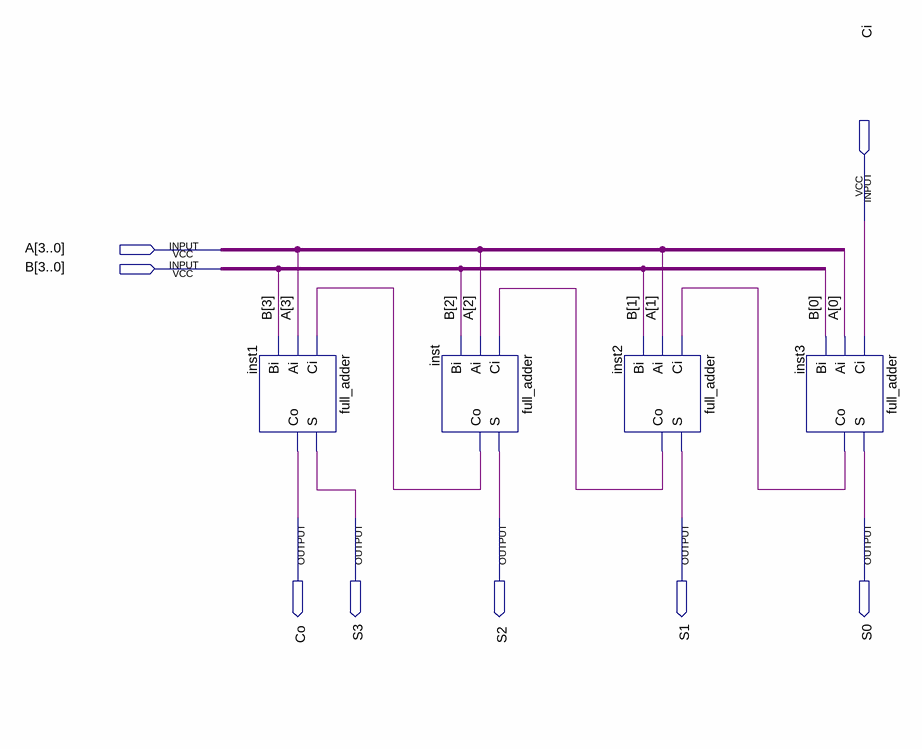
[diagram p0: schematic sheet]
// Quartus schematic ripple_adder.bdf as structural Verilog: 4 symbols, 8 pins
module ripple_adder (
  input  Ci,
  input  [3:0] A,
  input  [3:0] B,
  output Co,
  output S3,
  output S2,
  output S1,
  output S0
);

  wire inst2_co, inst3_co, inst_co;

  full_adder inst1 (.Ci(inst_co), .Ai(A[3]), .Bi(B[3]), .S(S3), .Co(Co));
  full_adder inst (.Ci(inst2_co), .Ai(A[2]), .Bi(B[2]), .S(S2), .Co(inst_co));
  full_adder inst2 (.Ci(inst3_co), .Ai(A[1]), .Bi(B[1]), .S(S1), .Co(inst2_co));
  full_adder inst3 (.Ci(Ci), .Ai(A[0]), .Bi(B[0]), .S(S0), .Co(inst3_co));
endmodule
